# Altium schematic sheet 单片机.SchDoc
size A3
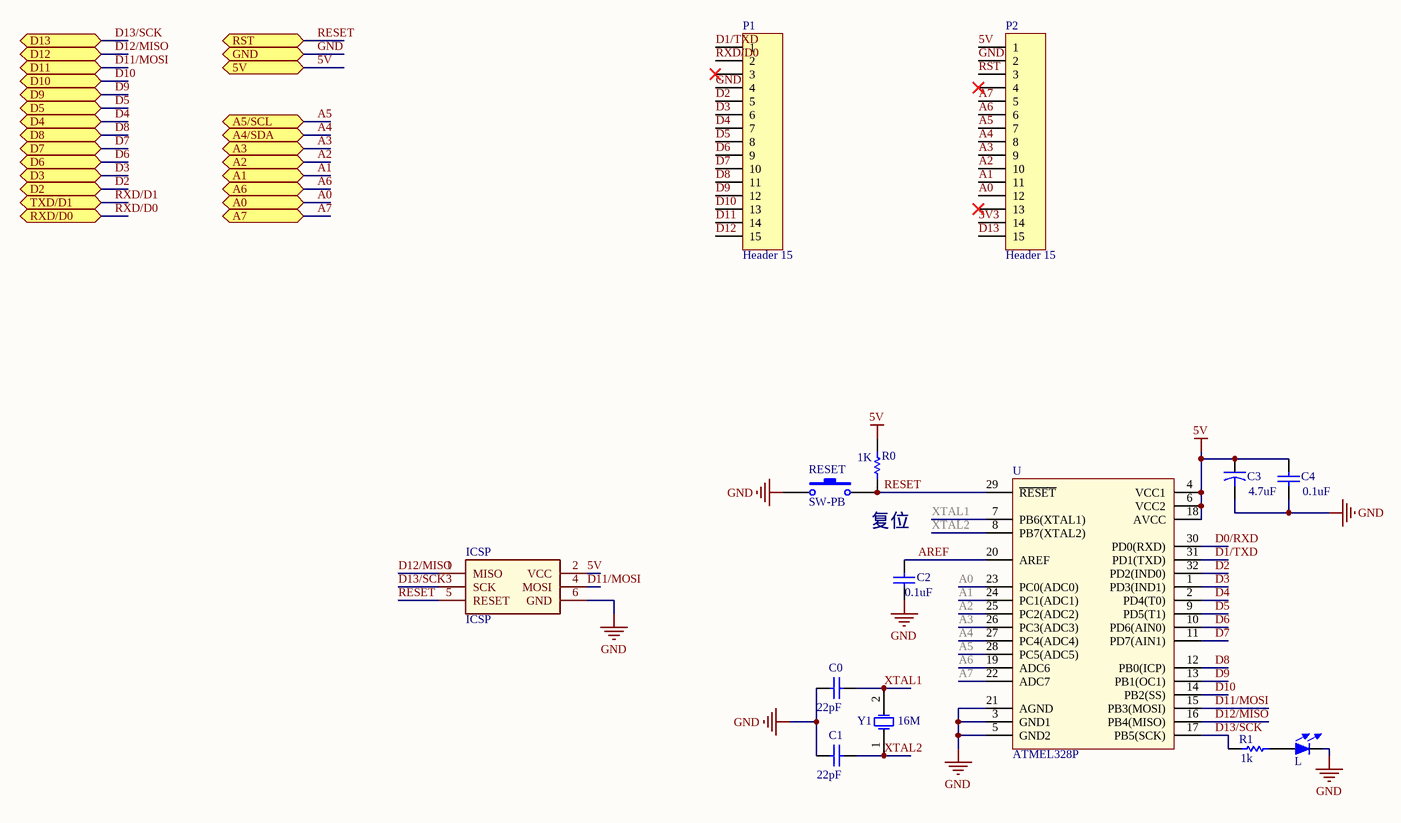
[diagram p0: 单片机.SchDoc]

## Parts
C0  value 22pF  [6-0805_N]  (hidden comment: Cap)
C1  value 22pF  [6-0805_N]  (hidden comment: Cap)
C2  value 0.1uF  [6-0805_N]  (hidden comment: Cap)
C3  value 4.7uF  [CAPR5-4X5]  (hidden comment: Cap2)
C4  value 0.1uF  [6-0805_N]  (hidden comment: Cap)
ICSP  ICSP  [DIP6]
L  LED  [LED_0805]  (value not drawn)
P1  Header 15  [HDR1X15]
P2  Header 15  [HDR1X15]
R0  value 1K  [6-0805_N]  (hidden comment: Res1)
R1  value 1k  [6-0805_N]  (hidden comment: Res1)
RESET  SW-PB  [KEY_SODFL_2-Leads]
U  ATMEL328P  [TQFP 32]
Y1  16M  [Crystal_Oscillator]

## Ports
5V, A0, A1, A2, A3, A4/SDA, A5/SCL, A6, A7, D2, D3, D4, D5, D6, D7, D8, D9, D10, D11, D12, D13, GND, RST, RXD/D0, TXD/D1

## Nets
5V: C3.1 C4.2 ICSP.2(VCC) P2.1 R0.2 U.4(VCC1) U.6(VCC2) U.18(AVCC) ; port 5V
GND: C0.1 C1.1 C2.1 C3.2 C4.1 ICSP.6(GND) L.2 P1.4 P2.2 RESET.1 U.3(GND1) U.5(GND2) U.21(AGND) ; port GND
3V3: P2.14
A0: P2.12 U.23(PC0(ADC0)) ; port A0
A1: P2.11 U.24(PC1(ADC1)) ; port A1
A2: P2.10 U.25(PC2(ADC2)) ; port A2
A3: P2.9 U.26(PC3(ADC3)) ; port A3
A4: P2.8 U.27(PC4(ADC4)) ; port A4/SDA
A5: P2.7 U.28(PC5(ADC5)) ; port A5/SCL
A6: P2.6 U.19(ADC6) ; port A6
A7: P2.5 U.22(ADC7) ; port A7
AREF: C2.2 U.20(AREF)
D0/RXD: U.30(PD0(RXD))
D1/TXD: P1.1 U.31(PD1(TXD))
D2: P1.5 U.32(PD2(IND0)) ; port D2
D3: P1.6 U.1(PD3(IND1)) ; port D3
D4: P1.7 U.2(PD4(T0)) ; port D4
D5: P1.8 U.9(PD5(T1)) ; port D5
D6: P1.9 U.10(PD6(AIN0)) ; port D6
D7: P1.10 U.11(PD7(AIN1)) ; port D7
D8: P1.11 U.12(PB0(ICP)) ; port D8
D9: P1.12 U.13(PB1(OC1)) ; port D9
D10: P1.13 U.14(PB2(SS)) ; port D10
D11: P1.14
D11/MOSI: ICSP.4(MOSI) U.15(PB3(MOSI)) ; port D11
D12: P1.15
D12/MISO: ICSP.1(MISO) U.16(PB4(MISO)) ; port D12
D13: P2.15
D13/SCK: ICSP.3(SCK) R1.2 U.17(PB5(SCK)) ; port D13
RESET: ICSP.5(RESET) R0.1 RESET.2 U.29(~{RESET}) ; port RST
RST: P2.3
RXD/D0: P1.2 ; port RXD/D0
RXD/D1: port TXD/D1
XTAL1: C0.2 U.7(PB6(XTAL1)) Y1.2(OSC2)
XTAL2: C1.2 U.8(PB7(XTAL2)) Y1.1(OSC1)
NetL_1: L.1 R1.1

Not connected (* = marked no-connect by the designer): P1 3*; P2 4* 13*

## Notes on the sheet
- 复位

## Library data of the parts
C0-C2 C4 = Cap: Capacitor; Published: 8-Jun-2000; LatestRevisionDate: 17-Jul-2002; LatestRevisionNote: Re-released for DXP Platform.; PackageReference: RAD-0.3; Publisher: Altium Limited; PackageDescription: Radial Cap, Thru-Hole; 2 Leads; 0.3 in Pin Spacing
C3 = Cap2: Capacitor; Published: 23-Sep-2002; PackageReference: CAPR5-4X5; Publisher: Altium Limited; PackageDescription: Capacitor; 2 Leads
P1 P2 = Header 15: Header, 15-Pin; LatestRevisionDate: 17-Jul-2002; LatestRevisionNote: Re-released for DXP Platform.; Publisher: Altium Limited
R0 R1 = Res1: Resistor; Published: 8-Jun-2000; LatestRevisionDate: 17-Jul-2002; LatestRevisionNote: Re-released for DXP Platform.; PackageReference: AXIAL-0.3; Publisher: Altium Limited; PackageDescription: Axial Device, Thru-Hole; 2 Leads; 0.3 in Pin Spacing
RESET = SW-PB: Switch; Published: 24-Mar-1999; LatestRevisionDate: 17-Jul-2002; LatestRevisionNote: Re-released for DXP Platform.; PackageReference: SPST-2; Publisher: Altium Limited; PackageDescription: Switch; 2 Leads
U = ATMEL-328P
Y1 = XTAL: Crystal Oscillator; Published: 8-Jun-2000; LatestRevisionDate: 17-Jul-2002; LatestRevisionNote: Re-released for DXP Platform.; PackageReference: R38; Publisher: Altium Limited; PackageDescription: Crystal, Thru-Hole; 2 Leads; Body 3.1 x 8.2 mm (Dia.xH)